# EAGLE design tsc_no_sensors (EAGLE 4.16)
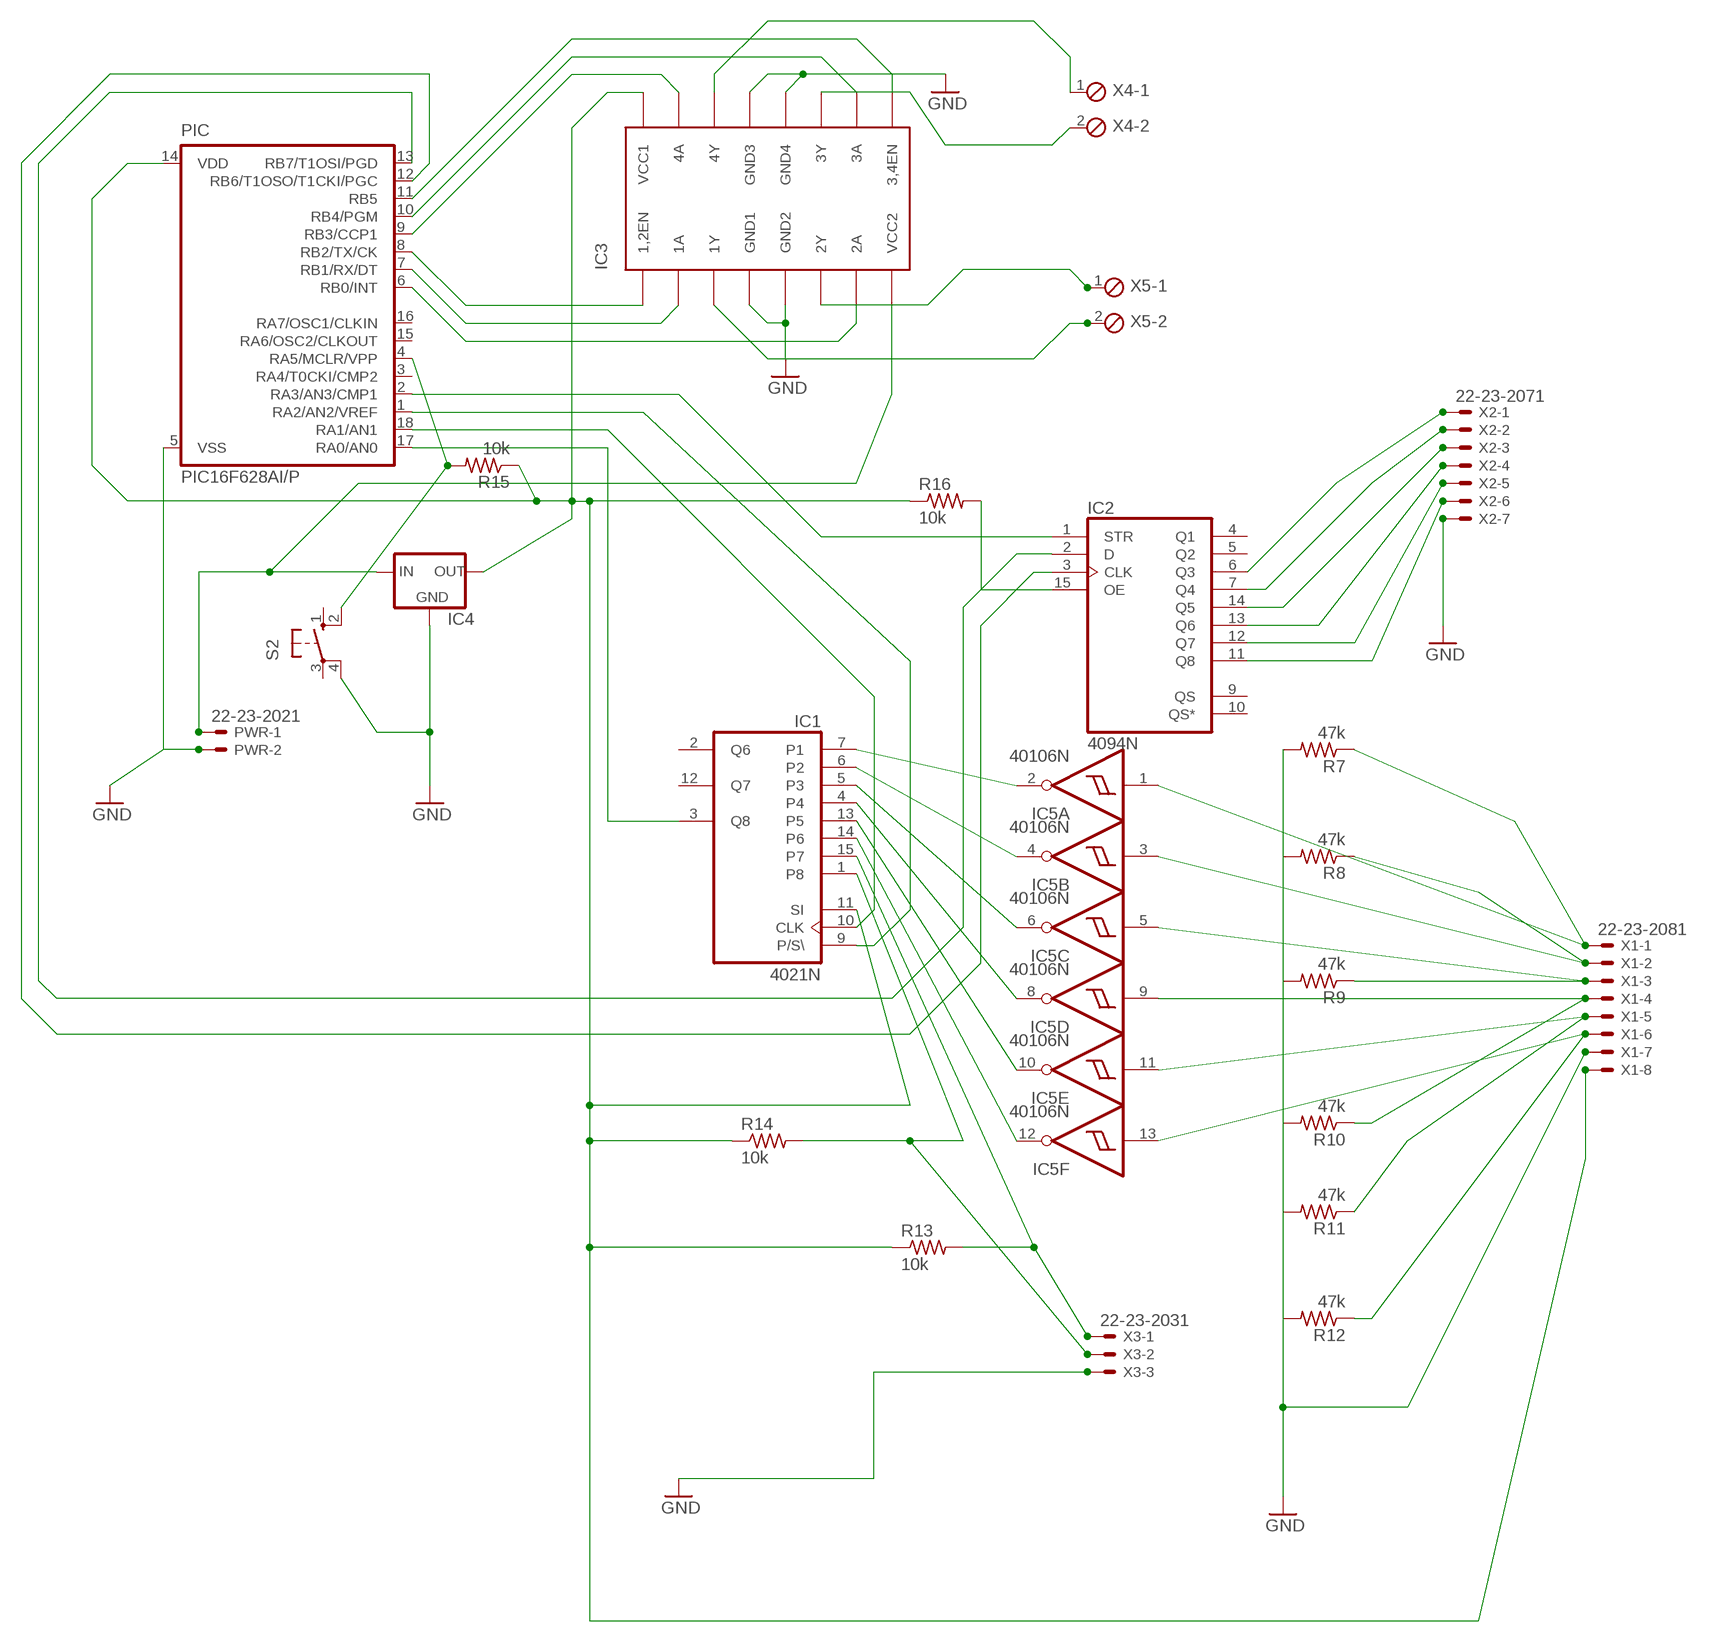
[diagram p0: schematic, sheet 1]

## Parts
IC1  4021N  [DIL16]
IC2  4094N  [DIL16]
IC3  L293D  [DIL16]
IC4  78LXX  [78LXX]
IC5  40106N  [DIL14]
PIC  PIC16F628AI/P  [DIL18]
PWR  22-23-2021  [22-23-2021]
R7  47k  R-US_0204/5  [0204/5]
R8  47k  R-US_0204/5  [0204/5]
R9  47k  R-US_0204/5  [0204/5]
R10  47k  R-US_0204/5  [0204/5]
R11  47k  R-US_0204/5  [0204/5]
R12  47k  R-US_0204/5  [0204/5]
R13  10k  R-US_0204/5  [0204/5]
R14  10k  R-US_0204/5  [0204/5]
R15  10k  R-US_0204/5  [0204/5]
R16  10k  R-US_0204/5  [0204/5]
S2  10-XX  [B3F-10XX]
X1  22-23-2081  [22-23-2081]
X2  22-23-2071  [22-23-2071]
X3  22-23-2031  [22-23-2031]
X4  MPT2  [2POL254]
X5  MPT2  [2POL254]

## Nets
GND: IC3.4(GND1) IC3.5(GND2) IC3.12(GND4) IC3.13(GND3) IC4.GND PIC.5(VSS) PWR.2 R7.2 R8.2 R9.2 R10.2 R11.2 R12.2 S2.4(P1) X1.7 X2.7 X3.3
N$1: IC3.7(2A) PIC.6(RB0/INT)
N$2: IC3.2(1A) PIC.7(RB1/RX/DT)
N$3: IC3.1(1,2EN) PIC.8(RB2/TX/CK)
N$4: IC3.15(4A) PIC.9(RB3/CCP1)
N$5: IC3.10(3A) PIC.10(RB4/PGM)
N$6: IC3.9(3,4EN) PIC.11(RB5)
N$7: IC3.8(VCC2) IC4.IN PWR.1
N$8: IC1.11(SI) IC3.16(VCC1) IC4.OUT PIC.14(VDD) R13.1 R14.1 R15.1 R16.1 X1.8
N$9: IC3.3(1Y) X5.2
N$10: IC3.6(2Y) X5.1
N$11: IC3.14(4Y) X4.1
N$12: IC3.11(3Y) X4.2
N$13: IC1.3(Q8) PIC.17(RA0/AN0)
N$14: IC1.10(CLK) PIC.18(RA1/AN1)
N$15: IC1.9(P/S\) PIC.1(RA2/AN2/VREF)
N$16: IC2.1(STR) PIC.2(RA3/AN3/CMP1)
N$17: IC2.2(D) PIC.13(RB7/T1OSI/PGD)
N$18: IC2.3(CLK) PIC.12(RB6/T1OSO/T1CKI/PGC)
N$20: IC2.15(OE) R16.2
N$24: IC2.11(Q8) X2.6
N$25: IC2.12(Q7) X2.5
N$26: IC2.13(Q6) X2.4
N$27: IC2.14(Q5) X2.3
N$28: IC2.7(Q4) X2.2
N$29: IC2.6(Q3) X2.1
N$33: IC5.1(A:I) R7.1 X1.1
N$34: IC5.3(B:I) R8.1 X1.2
N$35: IC5.5(C:I) R9.1 X1.3
N$36: IC5.9(D:I) R10.1 X1.4
N$37: IC5.11(E:I) R11.1 X1.5
N$38: IC5.13(F:I) R12.1 X1.6
N$39: IC1.1(P8) R14.2 X3.2
N$40: PIC.4(RA5/MCLR/VPP) R15.2 S2.2(S1)
N$46: IC1.7(P1) IC5.2(A:O)
N$47: IC1.6(P2) IC5.4(B:O)
N$48: IC1.5(P3) IC5.6(C:O)
N$49: IC1.4 IC5.8(D:O)
N$50: IC1.13(P5) IC5.10(E:O)
N$51: IC1.14(P6) IC5.12(F:O)
N$52: IC1.15(P7) R13.2 X3.1
Unconnected: IC1.2(Q6) IC1.12(Q7) IC2.4(Q1) IC2.5(Q2) IC2.9(QS) IC2.10(QS*) PIC.3(RA4/T0CKI/CMP2) PIC.15(RA6/OSC2/CLKOUT) PIC.16(RA7/OSC1/CLKIN) S2.1(S) S2.3(P)

## Power pins joined to a net without a drawn wire
VDD: IC1.16(VDD) IC2.16(VDD) IC5.14(P:VDD)
VSS: IC1.8(VSS) IC2.8(VSS) IC5.7(P:VSS)

## Library data of the parts
IC1 = 40xx:4021: 8-bit static SHIFT REGISTER
IC2 = 40xx:4094: 8-stage SHIFT/STORE REGISTER, tri-state
IC3 = sgs-thom:L293D
IC4 = v-reg:78LXX: VOLTAGE REGULATOR
IC5 = 40xx:40106: Hex SCHMITT TRIGGER
PIC = microchip-5:PIC16F628*: MICROCONTROLLER PIC16F628(A) 16 I/O One 16-bit timer Two 8-bit timer Two comparators USART CCP/PWM Precision 4 MHz internal oscillator 2k Program Flash memory 224 bytes SRAM 128 bytes EEPROM
PWR = con-molex:22-23-2021: .100" (2.54mm) Center Header - 2 Pin
R7-R16 = rcl:R-US_: RESISTOR, American symbol
S2 = switch-omron:10-XX: OMRON SWITCH
X1 = con-molex:22-23-2081: .100" (2.54mm) Center Header - 8 Pin
X2 = con-molex:22-23-2071: .100" (2.54mm) Center Header - 7 Pin
X3 = con-molex:22-23-2031: .100" (2.54mm) Center Header - 3 Pin
X4 X5 = con-phoenix-254:MPT2: PHOENIX CONNECTOR

## Board
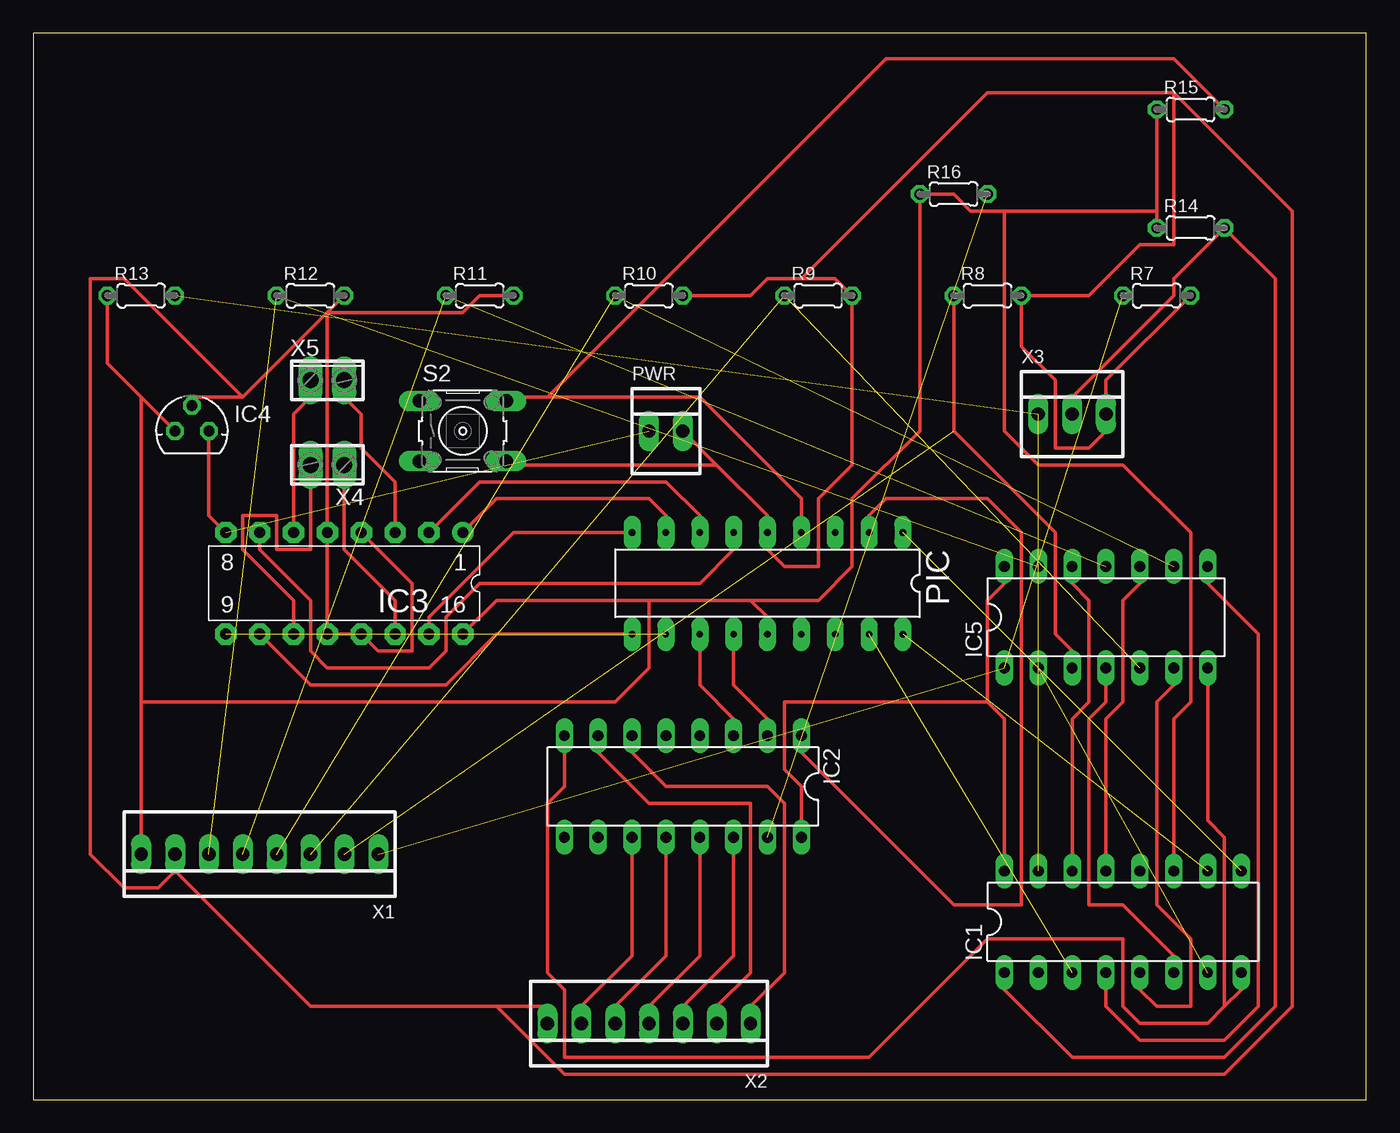
[diagram p1: board, top side]

Size 100 x 80 mm. Coordinates in mm from the lower left corner, seen from the top.
Outline: 0,0 100,0 100,80 0,80 0,0
Copper layers (1*2): Top 0.035mm / dielectric 1.5mm / layer 2 0.035mm
Design rules "default": minimum track width 10mil, minimum drill 24mil, track to track 8mil, track to pad 8mil, pad to pad 8mil, via to via 8mil, smd to smd 8mil, copper to edge 40mil, drill to drill 8mil, minimum pad ring 10mil, minimum via ring 8mil, stop-mask expansion 4mil, vias tented up to drill 0mil, thermal gap 10mil

### Footprints (pad centres in the part's own frame; a part is rotated, then mirrored left to right if it is on the bottom)
DIL16 = drill 0.813 long: 1 -8.89,-3.81; 2 -6.35,-3.81; 3 -3.81,-3.81; 4 -1.27,-3.81; 5 1.27,-3.81; 6 3.81,-3.81; 7 6.35,-3.81; 8 8.89,-3.81; 9 8.89,3.81; 10 6.35,3.81; 11 3.81,3.81; 12 1.27,3.81; 13 -1.27,3.81; 14 -3.81,3.81; 15 -6.35,3.81; 16 -8.89,3.81
DIL16' = drill 0.813 pad 1.6 round: 1 -8.89,-3.81 | drill 0.813 pad 1.6 octagon: 2 -6.35,-3.81; 3 -3.81,-3.81; 4 -1.27,-3.81; 5 1.27,-3.81; 6 3.81,-3.81; 7 6.35,-3.81; 8 8.89,-3.81; 9 8.89,3.81; 10 6.35,3.81; 11 3.81,3.81; 12 1.27,3.81; 13 -1.27,3.81; 14 -3.81,3.81; 15 -6.35,3.81; 16 -8.89,3.81
78LXX = drill 0.813 octagon: GND 0,1.905; IN 1.27,0; OUT -1.27,0
DIL14 = drill 0.813 long: 1 -7.62,-3.81; 2 -5.08,-3.81; 3 -2.54,-3.81; 4 0,-3.81; 5 2.54,-3.81; 6 5.08,-3.81; 7 7.62,-3.81; 8 7.62,3.81; 9 5.08,3.81; 10 2.54,3.81; 11 0,3.81; 12 -2.54,3.81; 13 -5.08,3.81; 14 -7.62,3.81
DIL18 = drill 0.5 pad 1.27 long: 1 -10.16,-3.81; 2 -7.62,-3.81; 3 -5.08,-3.81; 4 -2.54,-3.81; 5 0,-3.81; 6 2.54,-3.81; 7 5.08,-3.81; 8 7.62,-3.81; 9 10.16,-3.81; 10 10.16,3.81; 11 7.62,3.81; 12 5.08,3.81; 13 2.54,3.81; 14 0,3.81; 15 -2.54,3.81; 16 -5.08,3.81; 17 -7.62,3.81; 18 -10.16,3.81
22-23-2021 = drill 1 long: 1 -1.27,0; 2 1.27,0
0204/5 = drill 0.813 octagon: 1 -2.54,0; 2 2.54,0
B3F-10XX = drill 1.016 long: 1 -3.251,2.261; 2 3.251,2.261; 3 -3.251,-2.261; 4 3.251,-2.261
22-23-2081 = drill 1 long: 1 -8.89,0; 2 -6.35,0; 3 -3.81,0; 4 -1.27,0; 5 1.27,0; 6 3.81,0; 7 6.35,0; 8 8.89,0
22-23-2071 = drill 1 long: 1 -7.62,0; 2 -5.08,0; 3 -2.54,0; 4 0,0; 5 2.54,0; 6 5.08,0; 7 7.62,0
22-23-2031 = drill 1 long: 1 -2.54,0; 2 0,0; 3 2.54,0
2POL254 = drill 1.2 long: 1 -1.27,0; 2 1.27,0

### Placement (x,y rotation side)
IC1  81.75,13.33 0 top
IC2  48.73,23.49 180 top
IC3  [DIL16']  23.33,38.73 180 top
IC4  11.9,50.16 0 top
IC5  80.48,36.19 0 top
PIC  55.08,38.73 180 top
PWR  47.46,50.16 0 top
R7  84.29,60.32 0 top
R8  71.59,60.32 0 top
R9  58.89,60.32 0 top
R10  46.19,60.32 0 top
R11  33.49,60.32 0 top
R12  20.79,60.32 0 top
R13  8.09,60.32 0 top
R14  86.83,65.4 0 top
R15  86.83,74.29 0 top
R16  69.05,67.94 0 top
S2  32.22,50.16 0 top
X1  16.98,18.41 180 top
X2  46.19,5.71 180 top
X3  77.94,51.43 0 top
X4  22.06,47.62 180 top
X5  22.06,53.97 0 top

### Tracks (layer width: path | path; a pad name or v marks a point on that pad's centre or on a via)
GND
  Top 0.254: R7.2 80.48,53.97 X3.3 80.48,50.16 79.21,48.89 76.67,48.89 76.67,53.97 74.13,56.51 R8.2 79.21,60.32 83.02,64.13 85.56,64.13 85.56,75.56 | R10.2 53.81,60.32 55.08,61.59 57.62,61.59 | 57.62,61.59 60.16,61.59 R9.2 61.43,47.62 58.89,45.08 58.89,40 56.35,40 55.08,41.27 PIC.5 55.08,43.81 51.27,47.62 | 51.27,47.62 PWR.2 | 51.27,47.62 36.03,47.62 S2.4 | 85.56,75.56 71.59,75.56 57.62,61.59 | 10.63,17.14 20.79,6.98 34.76,6.98 | 34.76,6.98 38.57,6.98 X2.7 | IC3.4 28.41,38.73 28.41,33.65 25.87,33.65 IC3.13 IC3.12 IC3.5 22.06,59.05 | 15.71,52.7 11.9,52.7 IC4.GND | 22.06,59.05 R12.2 | 15.71,52.7 22.06,59.05 | R11.2 33.49,60.32 32.22,59.05 22.06,59.05 | 10.63,17.14 9.36,15.87 6.82,15.87 4.28,18.41 4.28,61.59 6.82,61.59 15.71,52.7 | 10.63,17.14 X1.7 | 85.56,75.56 94.45,66.67 94.45,6.98 89.37,1.9 39.84,1.9 34.76,6.98
N$1
  Top 0.254: PIC.6 52.54,41.27 50,38.73 33.49,38.73 30.95,36.19 30.95,33.65 29.68,32.38 22.06,32.38 20.79,33.65 20.79,37.46 16.98,41.27 IC3.7
N$2
  Top 0.254: PIC.7 50,43.81 47.46,46.35 33.49,46.35 IC3.2
N$3
  Top 0.254: PIC.8 47.46,43.81 46.19,45.08 34.76,45.08 IC3.1
N$4
  Top 0.254: PIC.9 36.03,42.54 29.68,36.19 IC3.15
N$5
  Top 0.254: PIC.10 34.76,34.92 30.95,31.11 20.79,31.11 IC3.10
N$6  (1 unrouted)
N$7  (1 unrouted)
  Top 0.254: IC4.IN 13.17,43.81 IC3.8
N$8
  Top 0.254: 84.29,66.67 R15.1 | 84.29,66.67 R14.1 | 72.86,66.67 84.29,66.67 | 72.86,66.67 70.32,66.67 69.05,67.94 R16.1 66.51,50.16 61.43,45.08 61.43,40 58.89,37.46 53.81,37.46 | 72.86,66.67 72.86,50.16 75.4,47.62 81.75,47.62 86.83,42.54 86.83,29.84 85.56,28.57 IC1.11 | PIC.14 55.08,36.19 53.81,37.46 | 46.19,37.46 34.76,37.46 IC3.16 | 46.19,37.46 53.81,37.46 | 8.09,52.7 5.55,55.24 R13.1 | 8.09,52.7 IC4.OUT | 8.09,29.84 8.09,52.7 | X1.8 8.09,29.84 | 46.19,37.46 46.19,32.38 43.65,29.84 8.09,29.84
N$9
  Top 0.254: IC3.3 27.14,46.35 24.6,48.89 24.6,51.43 23.33,52.7 X5.2
N$10
  Top 0.254: IC3.6 19.52,51.43 20.79,52.7 X5.1
N$11
  Top 0.254: IC3.14 27.14,37.46 23.33,41.27 X4.1
N$12
  Top 0.254: IC3.11 19.52,37.46 15.71,41.27 15.71,43.81 18.25,43.81 18.25,41.27 20.79,41.27 X4.2
N$13  (1 unrouted)
N$14  (1 unrouted)
N$15  (1 unrouted)
N$16
  Top 0.254: PIC.2 62.7,43.81 63.97,45.08 71.59,45.08 74.13,42.54 74.13,14.6 69.05,14.6 57.62,26.03 IC2.1
N$17
  Top 0.254: PIC.13 52.54,31.11 55.08,28.57 IC2.2
N$18
  Top 0.254: PIC.12 50,31.11 52.54,28.57 IC2.3
N$20  (1 unrouted)
N$24
  Top 0.254: IC2.11 44.92,10.79 41.11,6.98 X2.6
N$25
  Top 0.254: IC2.12 47.46,10.79 43.65,6.98 X2.5
N$26
  Top 0.254: IC2.13 50,10.79 46.19,6.98 X2.4
N$27
  Top 0.254: IC2.14 52.54,10.79 48.73,6.98 X2.3
N$28
  Top 0.254: IC2.7 42.38,26.03 46.19,22.22 53.81,22.22 53.81,9.52 51.27,6.98 X2.2
N$29
  Top 0.254: IC2.6 44.92,26.03 47.46,23.49 55.08,23.49 56.35,22.22 56.35,9.52 53.81,6.98 X2.1
N$33  (2 unrouted)
N$34  (1 unrouted)
  Top 0.254: R8.1 69.05,50.16 76.67,42.54 76.67,34.92 77.94,33.65 IC5.3
N$35  (2 unrouted)
N$36  (2 unrouted)
N$37  (2 unrouted)
N$38  (2 unrouted)
N$39
  Top 0.254: IC1.1 72.86,8.25 77.94,3.17 89.37,3.17 93.18,6.98 93.18,61.59 R14.2 85.56,61.59 85.56,60.32 77.94,52.7 X3.2
N$40
  Top 0.254: PIC.4 57.62,45.08 50,52.7 38.57,52.7 | 38.57,52.7 36.03,52.7 S2.2 | R15.2 85.56,78.1 63.97,78.1 38.57,52.7
N$46  (1 unrouted)
N$47
  Top 0.254: IC1.6 85.56,10.79 81.75,14.6 79.21,14.6 79.21,28.57 80.48,29.84 IC5.4
N$48
  Top 0.254: IC1.5 83.02,8.25 84.29,6.98 86.83,6.98 86.83,12.06 84.29,14.6 84.29,29.84 85.56,31.11 IC5.6
N$49
  Top 0.254: IC1.4 80.48,6.98 83.02,4.44 89.37,4.44 91.91,6.98 91.91,34.92 88.1,38.73 IC5.8
N$50
  Top 0.254: IC1.13 80.48,28.57 81.75,29.84 81.75,37.46 83.02,38.73 IC5.10
N$51
  Top 0.254: IC1.14 77.94,28.57 79.21,29.84 79.21,37.46 77.94,38.73 IC5.12
N$52  (2 unrouted)
VDD
  Top 0.254: 71.59,29.84 72.86,28.57 IC1.16 | 71.59,29.84 71.59,37.46 72.86,38.73 IC5.14 | 71.59,29.84 56.35,29.84 56.35,24.76 57.62,23.49 IC2.16
VSS
  Top 0.254: 89.37,6.98 90.64,8.25 IC1.8 | 89.37,6.98 88.1,5.71 83.02,5.71 81.75,6.98 81.75,12.06 71.59,12.06 62.7,3.17 39.84,3.17 39.84,8.25 38.57,9.52 38.57,22.22 39.84,23.49 IC2.8 | 89.37,6.98 89.37,19.68 88.1,20.95 IC5.7